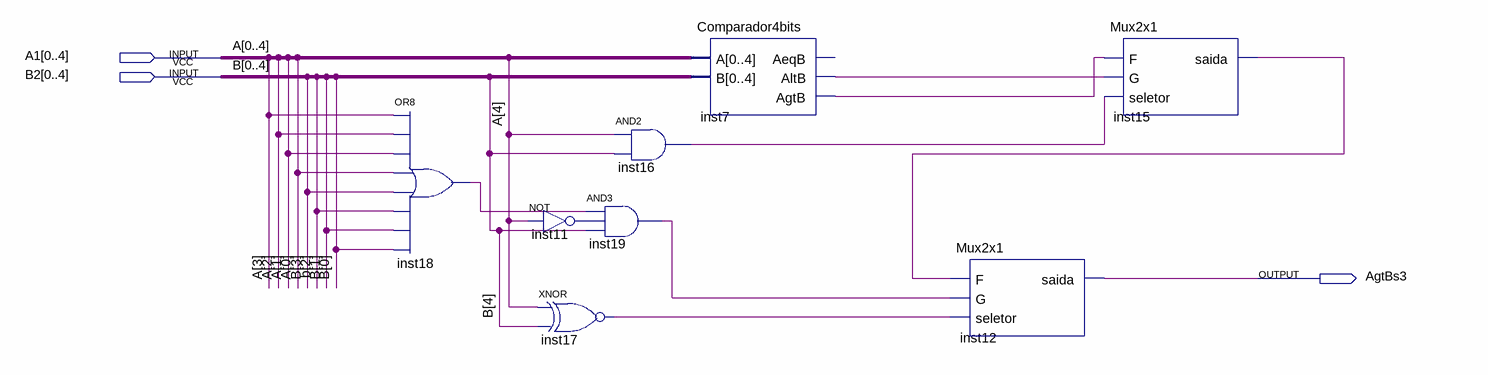
[diagram p0: schematic sheet]
// Quartus schematic Comparador4bitsSinalAltB.bdf as structural Verilog: 8 symbols, 3 pins
module Comparador4bitsSinalAltB (
  input  [0:4] A1,
  input  [0:4] B2,
  output AgtBs3
);

  wire inst7_agtb, inst7_altb, inst11_out, inst15_saida, inst16_out, inst17_out, inst18_out, inst19_out;

  or inst18 (inst18_out, A1[3], A1[2], A1[1], A1[0], B2[3], B2[2], B2[1], B2[0]);
  not inst11 (inst11_out, A1[4]);
  xnor inst17 (inst17_out, A1[4], B2[4]);
  and inst16 (inst16_out, A1[4], B2[4]);
  and inst19 (inst19_out, inst18_out, inst11_out, B2[4]);
  Comparador4bits inst7 (.A(A1), .B(B2), .AltB(inst7_altb), .AgtB(inst7_agtb));  // open: AeqB
  Mux2x1 inst12 (.F(inst15_saida), .G(inst19_out), .seletor(inst17_out), .saida(AgtBs3));
  Mux2x1 inst15 (.F(inst7_agtb), .G(inst7_altb), .seletor(inst16_out), .saida(inst15_saida));

  // Other names for the same wires on the sheet: A[4:0] = {A1[4], A1[3], A1[2], A1[1], A1[0]};
  //   B[4:0] = {B2[4], B2[3], B2[2], B2[1], B2[0]}
endmodule
